# EAGLE design rpi2_lcd2 (EAGLE 7.7.0)
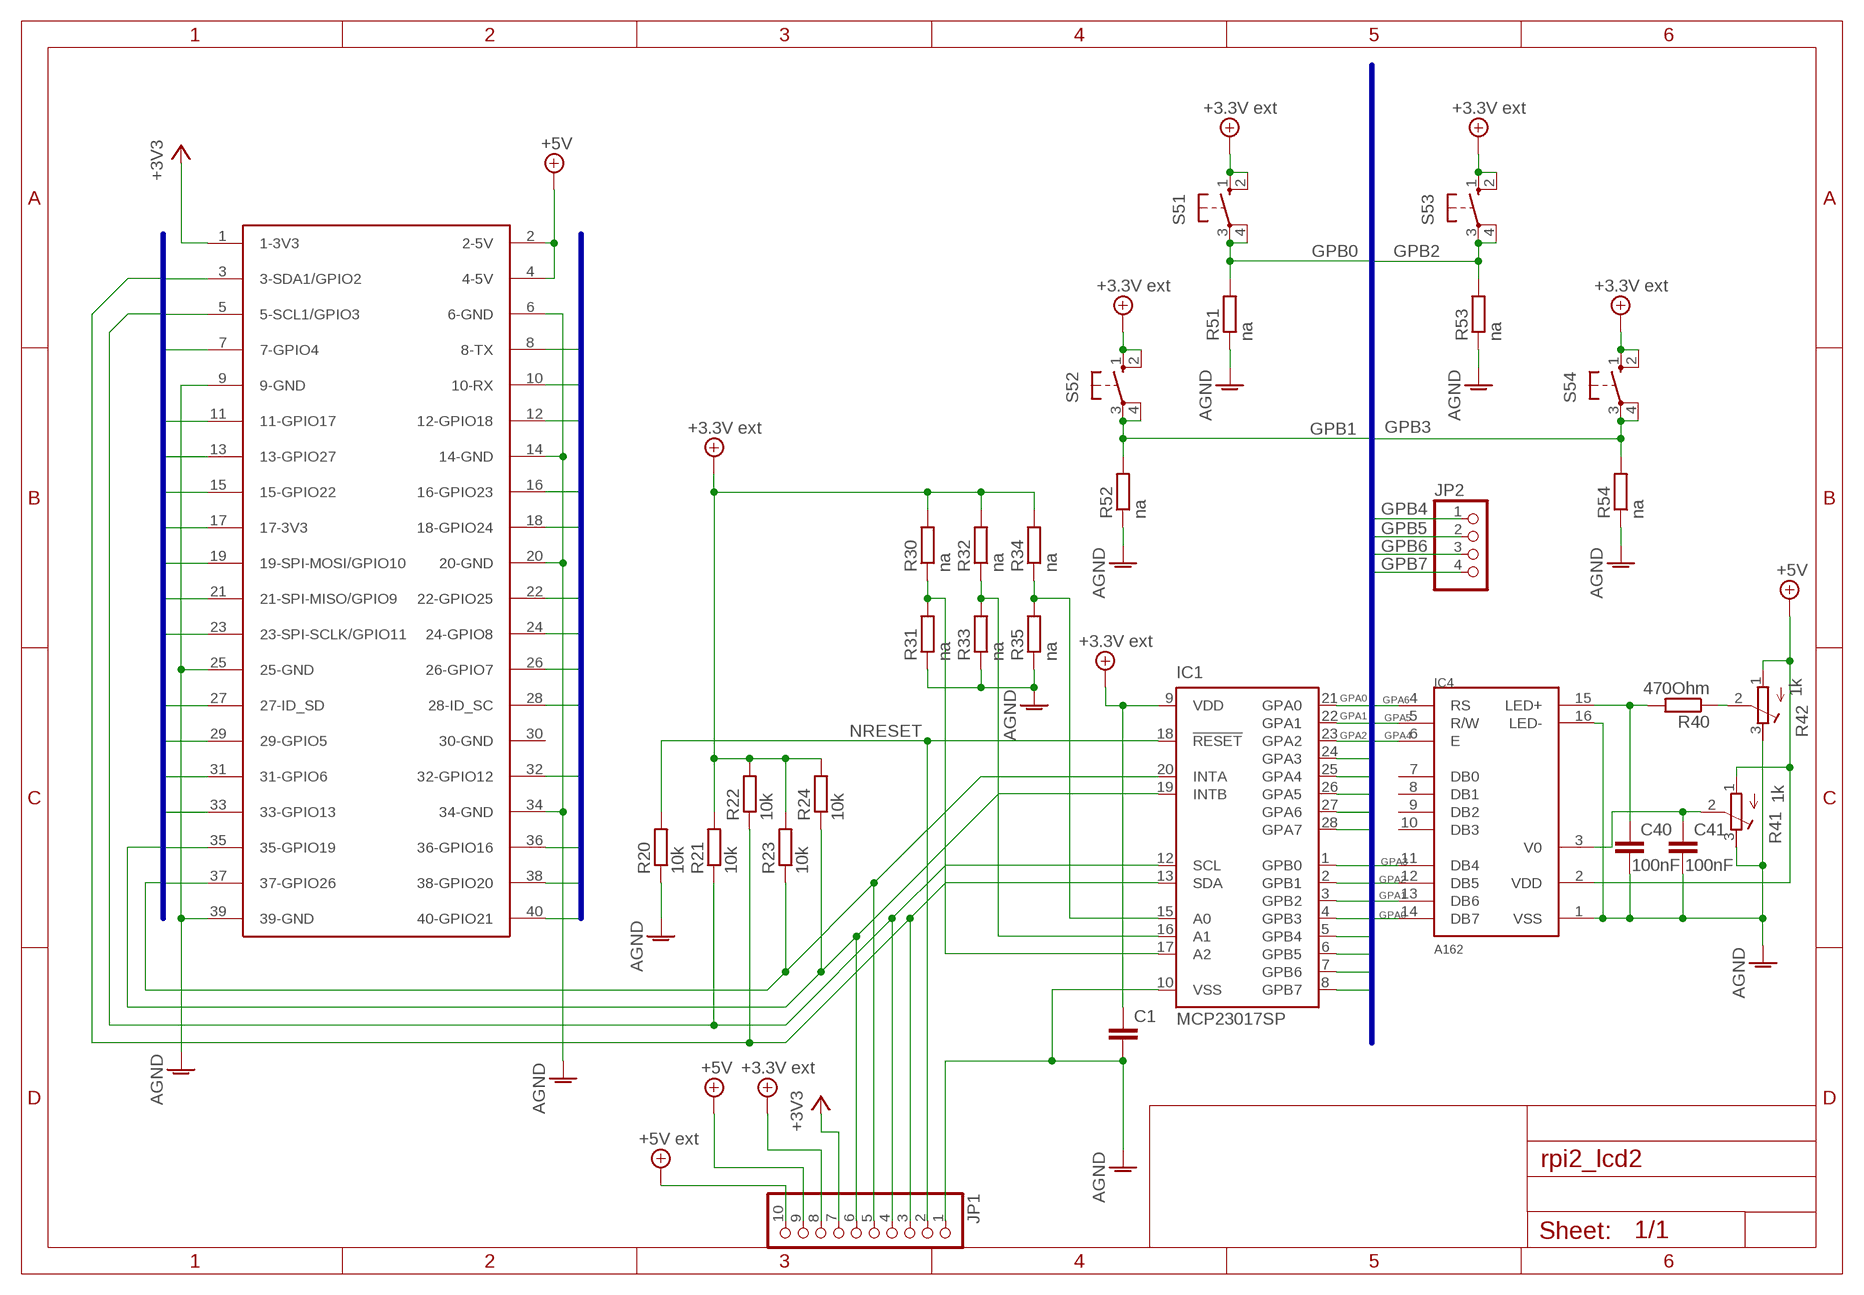
[diagram p0: schematic, sheet 1]

## Parts
C1  C-EUC1210  [C1210]
C40  100nF  C-EUC1210  [C1210]
C41  100nF  C-EUC1210  [C1210]
IC1  MCP23017SP  [DIL28-3]
IC4  A162  [A162]
JP1  PINHD-1X10  [1X10]
JP2  PINHD-1X4  [1X04]
R20  10k  R-EU_R0805  [R0805]
R21  10k  R-EU_R0805  [R0805]
R22  10k  R-EU_R0805  [R0805]
R23  10k  R-EU_R0805  [R0805]
R24  10k  R-EU_R0805  [R0805]
R30  na  R-EU_R0805  [R0805]
R31  na  R-EU_R0805  [R0805]
R32  na  R-EU_R0805  [R0805]
R33  na  R-EU_R0805  [R0805]
R34  na  R-EU_R0805  [R0805]
R35  na  R-EU_R0805  [R0805]
R40  470Ohm  R-EU_R0805  [R0805]
R41  1k  R-TRIMM3339P  [RTRIM3339P]
R42  1k  R-TRIMM3339P  [RTRIM3339P]
R51  na  R-EU_R0805  [R0805]
R52  na  R-EU_R0805  [R0805]
R53  na  R-EU_R0805  [R0805]
R54  na  R-EU_R0805  [R0805]
S51  10-XX  [B3F-10XX]
S52  10-XX  [B3F-10XX]
S53  10-XX  [B3F-10XX]
S54  10-XX  [B3F-10XX]
U$1  RASPBERRY-PI+HEADERONLY  [RASPBERRY-PI-PLUS-HEADERONLY]

## Nets
3.3VEXT: C1.1 IC1.9(VDD) JP1.8 R21.2 R22.2 R23.2 R24.2 R30.2 R32.2 R34.2 ; supply symbol labelled +3.3V ext
+3V3: JP1.7 U$1.1(1-3V3)
+5V: IC4.2(VDD) JP1.9 R41.1(A) R42.1(A) U$1.2(2-5V) U$1.4(4-5V)
+5V/1: JP1.10 ; supply symbol labelled +5V ext
+5V/2: S51.1(S) S51.2(S1) S52.1(S) S52.2(S1) S53.1(S) S53.2(S1) S54.1(S) S54.2(S1) ; supply symbol labelled +3.3V ext
AGND: C1.2 C40.2 C41.2 IC1.10(VSS) IC4.1(VSS) IC4.16(LED-) JP1.1 R20.1 R31.1 R33.1 R35.1 R41.3(E) R42.3(E) R51.1 R52.1 R53.1 R54.1 U$1.6(6-GND) U$1.9(9-GND) U$1.14(14-GND) U$1.20(20-GND) U$1.25(25-GND) U$1.34(34-GND) U$1.39(39-GND)
GPA0: IC1.21(GPA0) IC4.14(DB7)
GPA1: IC1.22(GPA1) IC4.13(DB6)
GPA2: IC1.23(GPA2) IC4.12(DB5)
GPA3: IC1.24(GPA3) IC4.11(DB4)
GPA4: IC1.25(GPA4) IC4.6(E)
GPA5: IC1.26(GPA5) IC4.5(R/W)
GPA6: IC1.27(GPA6) IC4.4(RS)
GPA7: IC1.28(GPA7)
GPB0: IC1.1(GPB0) R51.2 S51.3(P) S51.4(P1)
GPB1: IC1.2(GPB1) R52.2 S52.3(P) S52.4(P1)
GPB2: IC1.3(GPB2) R53.2 S53.3(P) S53.4(P1)
GPB3: IC1.4(GPB3) R54.2 S54.3(P) S54.4(P1)
GPB4: IC1.5(GPB4) JP2.1
GPB5: IC1.6(GPB5) JP2.2
GPB6: IC1.7(GPB6) JP2.3
GPB7: IC1.8(GPB7) JP2.4
GPIO3: IC1.13(SDA) JP1.3 R22.1 U$1.3(3-SDA1/GPIO2)
GPIO5: IC1.12(SCL) JP1.4 R21.1 U$1.5(5-SCL1/GPIO3)
GPIO7: U$1.7(7-GPIO4)
GPIO8: U$1.8(8-TX)
GPIO10: U$1.10(10-RX)
GPIO11: U$1.11(11-GPIO17)
GPIO12: U$1.12(12-GPIO18)
GPIO13: U$1.13(13-GPIO27)
GPIO15: U$1.15(15-GPIO22)
GPIO16: U$1.16(16-GPIO23)
GPIO17: U$1.17(17-3V3)
GPIO18: U$1.18(18-GPIO24)
GPIO19: U$1.19(19-SPI-MOSI/GPIO10)
GPIO21: U$1.21(21-SPI-MISO/GPIO9)
GPIO22: U$1.22(22-GPIO25)
GPIO23: U$1.23(23-SPI-SCLK/GPIO11)
GPIO24: U$1.24(24-GPIO8)
GPIO26: U$1.26(26-GPIO7)
GPIO27: U$1.27(27-ID_SD)
GPIO28: U$1.28(28-ID_SC)
GPIO29: U$1.29(29-GPIO5)
GPIO31: U$1.31(31-GPIO6)
GPIO32: U$1.32(32-GPIO12)
GPIO33: U$1.33(33-GPIO13)
GPIO35: IC1.19(INTB) JP1.6 R24.1 U$1.35(35-GPIO19)
GPIO36: U$1.36(36-GPIO16)
GPIO37: IC1.20(INTA) JP1.5 R23.1 U$1.37(37-GPIO26)
GPIO38: U$1.38(38-GPIO20)
GPIO40: U$1.40(40-GPIO21)
N$1: R40.1 R42.2(S)
N$2: C40.1 IC4.15(LED+) R40.2
N$3: C41.1 IC4.3(V0) R41.2(S)
N$23: IC1.17(A2) R30.1 R31.2
N$29: IC1.16(A1) R32.1 R33.2
N$30: IC1.15(A0) R34.1 R35.2
NRESET: IC1.18(!RESET) JP1.2 R20.2
Unconnected: IC4.7(DB0) IC4.8(DB1) IC4.9(DB2) IC4.10(DB3) U$1.30(30-GND)

## Buses
GPA[0..7],GPB[0..7]
GPIO[1..40]

## Library data of the parts
C1 C40 C41 = rcl:C-EU: CAPACITOR, European symbol
IC1 = microchip:MCP23017: http://ww1.microchip.com/downloads/en/DeviceDoc/21952a.pdf Source: http://ww1.microchip.com/downloads/en/DeviceDoc/21952a.pdf; MF: MICROCHIP; MPN: MCP23017-E/SP; OC_FARNELL: 1332088; OC_NEWARK: 31K2959
IC4 = display:A162
JP1 = pinhead:PINHD-1X10: PIN HEADER
JP2 = pinhead:PINHD-1X4: PIN HEADER
R20-R24 R30-R35 R40 R51-R54 = rcl:R-EU_: RESISTOR, European symbol
R41 R42 = rcl:R-TRIMM: Trimm resistor
S51-S54 = switch-omron:10-XX: OMRON SWITCH; MPN: B3F-1000; OC_FARNELL: 176432; OC_NEWARK: 36M3542
U$1 = Ava:RASPBERRY-PI+: Samtec SSW-120-01-T-D

## Board
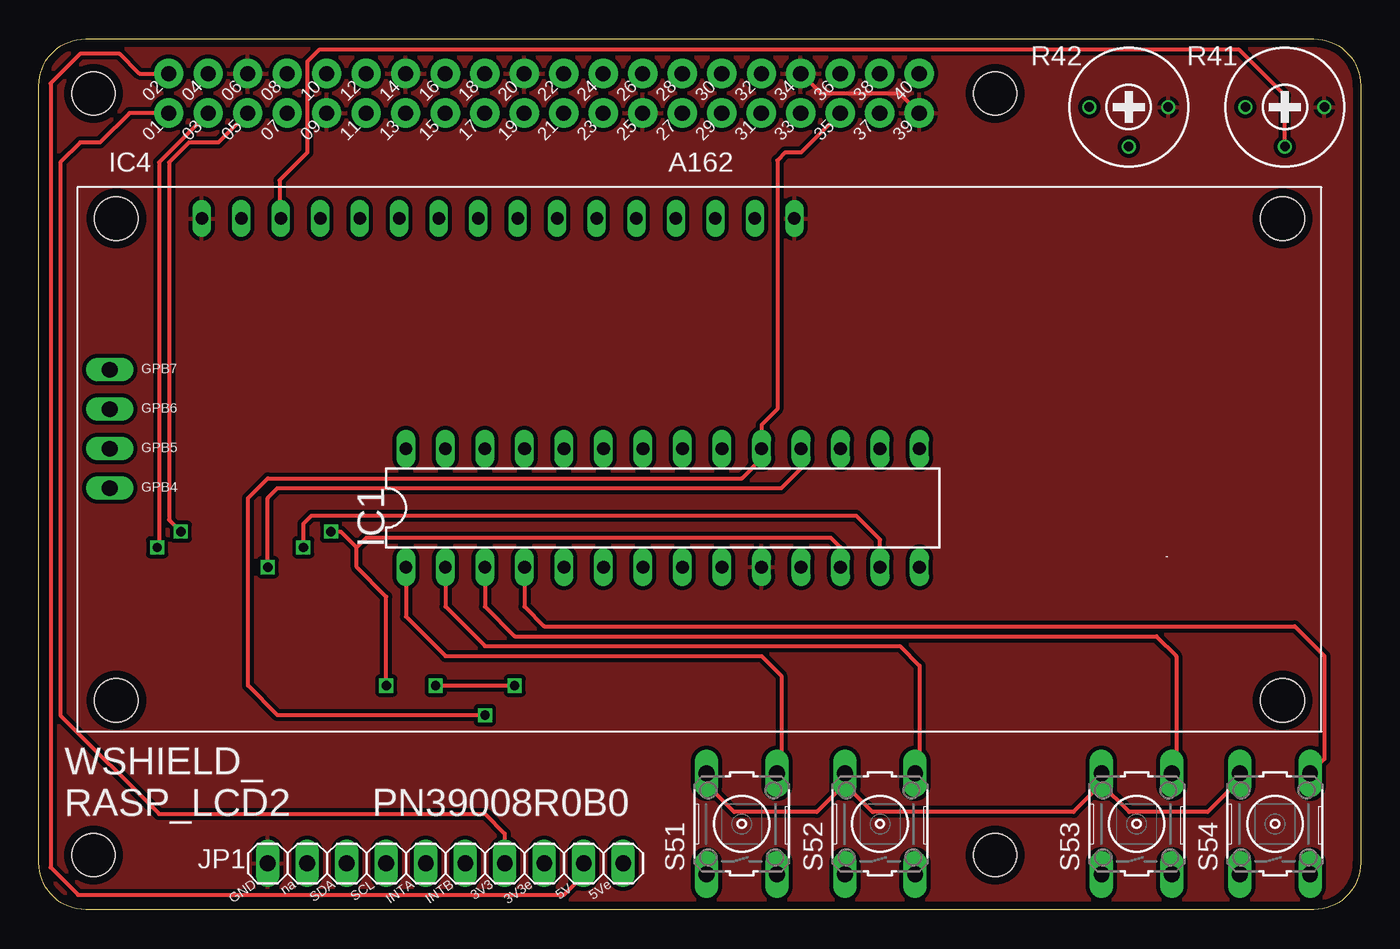
[diagram p1: board, top side]
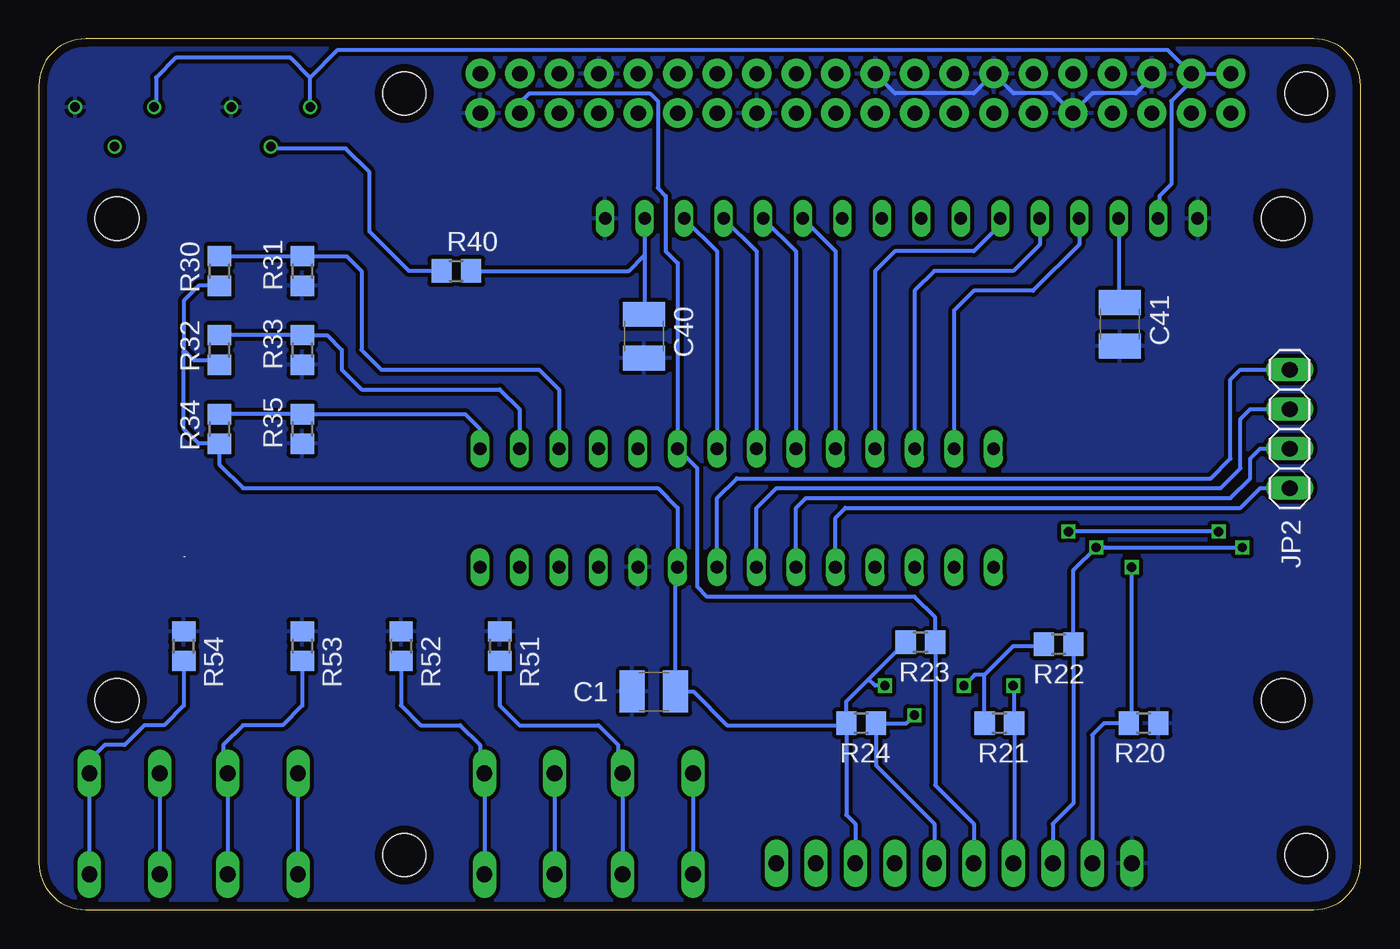
[diagram p2: board, bottom side, seen from below]

Size 85 x 56 mm. Coordinates in mm from the lower left corner, seen from the top.
Outline: 0,53 arc-90 3,56 82,56 arc-90 85,53 85,3 arc-90 82,0 3,0 arc-90 0,3 0,53
Copper layers (1*16): Top 0.035mm / dielectric 1.6mm / Bottom 0.035mm
Design rules "Elecrow_2-layer_PCB_eagle_rule": minimum track width 6mil, minimum drill 12mil, track to track 6mil, track to pad 6mil, pad to pad 6mil, via to via 8mil, smd to smd 0mil, copper to edge 20mil, drill to drill 10mil, minimum pad ring 6mil, minimum via ring 6mil, stop-mask expansion 0mil, vias tented up to drill 100mil, thermal gap 10mil
Holes 2.75 mm at 3.5,52.5 3.5,3.5 61.5,52.5 61.5,3.5

### Footprints (pad centres in the part's own frame; a part is rotated, then mirrored left to right if it is on the bottom)
C1210 = smd 1.6 x 2.7: 1 -1.4,0; 2 1.4,0
DIL28-3 = drill 0.813 long: 1 -16.51,-3.81; 2 -13.97,-3.81; 3 -11.43,-3.81; 4 -8.89,-3.81; 5 -6.35,-3.81; 6 -3.81,-3.81; 7 -1.27,-3.81; 8 1.27,-3.81; 9 3.81,-3.81; 10 6.35,-3.81; 11 8.89,-3.81; 12 11.43,-3.81; 13 13.97,-3.81; 14 16.51,-3.81; 15 16.51,3.81; 16 13.97,3.81; 17 11.43,3.81; 18 8.89,3.81; 19 6.35,3.81; 20 3.81,3.81; 21 1.27,3.81; 22 -1.27,3.81; 23 -3.81,3.81; 24 -6.35,3.81; 25 -8.89,3.81; 26 -11.43,3.81; 27 -13.97,3.81; 28 -16.51,3.81
A162 = drill 0.8 long: 1 0,0; 2 2.54,0; 3 5.08,0; 4 7.62,0; 5 10.16,0; 6 12.7,0; 7 15.24,0; 8 17.78,0; 9 20.32,0; 10 22.86,0; 11 25.4,0; 12 27.94,0; 13 30.48,0; 14 33.02,0; 15 35.56,0; 16 38.1,0 | hole 2.8: -5.5,0; -5.5,-31; 69.5,0; 69.5,-31
1X10 = drill 1.016 long: 1 -11.43,0; 2 -8.89,0; 3 -6.35,0; 4 -3.81,0; 5 -1.27,0; 6 1.27,0; 7 3.81,0; 8 6.35,0; 9 8.89,0; 10 11.43,0
1X04 = drill 1.016 long: 1 -3.81,0; 2 -1.27,0; 3 1.27,0; 4 3.81,0
R0805 = smd 1.3 x 1.5: 1 -0.95,0; 2 0.95,0
RTRIM3339P = drill 0.61: 1 -2.54,0; 2 0,-2.54; 3 2.54,0
B3F-10XX = drill 1.016 long: 1 -3.251,2.261; 2 3.251,2.261; 3 -3.251,-2.261; 4 3.251,-2.261
RASPBERRY-PI-PLUS-HEADERONLY = drill 0.97 pad 1.88: 1 -23.97,-1.218; 2 -23.97,1.323; 3 -21.43,-1.218; 4 -21.43,1.323; 5 -18.89,-1.218; 6 -18.89,1.323; 7 -16.35,-1.218; 8 -16.35,1.323; 9 -13.81,-1.218; 10 -13.81,1.323; 11 -11.27,-1.218; 12 -11.27,1.323; 13 -8.73,-1.218; 14 -8.73,1.323; 15 -6.19,-1.218; 16 -6.19,1.323; 17 -3.65,-1.218; 18 -3.65,1.323; 19 -1.11,-1.218; 20 -1.11,1.323; 21 1.43,-1.218; 22 1.43,1.323; 23 3.97,-1.218; 24 3.97,1.323; 25 6.51,-1.218; 26 6.51,1.323; 27 9.05,-1.218; 28 9.05,1.323; 29 11.59,-1.218; 30 11.59,1.323; 31 14.13,-1.218; 32 14.14,1.323; 33 16.67,-1.218; 34 16.67,1.323; 35 19.21,-1.218; 36 19.21,1.323; 37 21.75,-1.218; 38 21.75,1.323; 39 24.29,-1.218; 40 24.29,1.323

### Placement (x,y rotation side)
C1  45.45,14.02 180 bottom
C40  46.09,36.88 270 bottom
C41  15.48,37.64 270 bottom
IC1  40.12,25.83 0 top
IC4  10.48,44.45 0 top
JP1  26.15,2.97 0 top
JP2  4.56,30.91 90 bottom
R20  13.96,11.99 180 bottom
R21  23.23,11.99 180 bottom
R22  19.42,17.07 180 bottom
R23  28.31,17.19 180 bottom
R24  32.12,11.99 180 bottom
R30  73.39,41.07 270 bottom
R31  68.06,41.07 90 bottom
R32  73.39,35.99 270 bottom
R33  68.06,35.99 90 bottom
R34  73.39,30.91 270 bottom
R35  68.06,30.91 90 bottom
R40  58.15,41.07 0 bottom
R41  80.12,51.61 0 top
R42  70.09,51.61 0 top
R51  55.36,16.94 270 bottom
R52  61.71,16.94 270 bottom
R53  68.06,16.94 270 bottom
R54  75.68,16.94 270 bottom
S51  45.2,5.51 90 top
S52  54.09,5.51 90 top
S53  70.6,5.51 90 top
S54  79.49,5.51 90 top
U$1  32.32,52.45 0 top
U$2  [BRAND_SWI]  80.76,20.12 0 bottom
U$3  [BRAND_SWI]  67.42,20.12 0 top

### Tracks (layer width: path | path; a pad name or v marks a point on that pad's centre or on a via)
3.3VEXT  (via drill 0.6)
  Top 0.254: v25.52,14.4 v30.59,14.4
  Bottom 0.254: R30.2 74.72,40.12 75.68,39.16 75.68,35.99 | 75.68,35.99 75.04,35.36 73.71,35.36 R32.2 | 75.68,35.99 75.68,30.91 74.73,29.96 R34.2 73.39,28.62 71.87,27.1 45.2,27.1 43.93,25.83 IC1.9 44.05,21.9 C1.1 42.91,14.02 40.76,11.86 33.2,11.86 R24.2 | R24.2 33.07,6.08 32.5,5.51 JP1.8 | R24.2 33.07,13.38 31.64,14.81 | 31.64,14.81 R23.2 | R21.2 24.18,15.1 | 24.18,15.1 22.34,16.94 20.5,16.94 R22.2 | 24.18,15.1 24.81,15.1 v25.52,14.4 | v30.59,14.4 31.23,14.4 31.64,14.81
+3V3
  Top 0.254: U$1.1 5.83,51.23 3.92,49.33 2.66,49.33 1.38,48.05 1.38,12.5 7.74,6.15 28.69,6.15 29.96,4.88 JP1.7
+5V
  Top 0.254: U$1.2 6.46,53.77 5.2,55.04 2.66,55.04 0.75,53.13 0.75,2.72 2.53,0.94 33.77,0.94 35.04,2.21 JP1.9
  Bottom 0.254: 67.55,53.52 68.82,54.79 76.19,54.79 77.46,53.52 77.46,51.74 R41.1 | R42.1 67.55,53.52 | 67.55,53.52 65.77,55.29 12.41,55.29 U$1.4 | U$1.4 10.89,53.28 12.18,51.99 12.18,46.66 12.94,45.9 12.94,44.52 IC4.2 | U$1.4 U$1.2
+5V/2
  Top 0.254: S54.2 77.23,8.33 75.17,6.27 70.12,6.27 68.34,8.05 S53.2 68.34,8.08 66.54,6.27 53.61,6.27 51.83,8.05 S52.2 51.83,8.08 50.03,6.27 44.72,6.27 42.94,8.05 S51.2
  Bottom 0.254: S52.2 S52.1 | S51.2 S51.1 | S53.1 S53.2 | S54.2 S54.1
AGND
  Top 0.254: U$1.34 49.01,53.77 50.28,52.5 55.34,52.5 U$1.39
  Bottom 0.254: U$1.6 13.43,53.53 14.47,52.5 17.24,52.5 U$1.9 18.53,51.23 19.8,52.5 22.32,52.5 U$1.14 23.61,53.77 24.88,52.5 29.94,52.5 U$1.20
  pour Bottom (isolate 0.254): -0.01,53.26 arc-90 2.78,56.06 3.04,56.06 82.28,56.06 arc-90 85.08,53.26 85.08,2.72 arc-90 82.28,-0.08 82.03,-0.08 3.04,-0.08 arc-90 -0.01,2.97
  pour Top (isolate 0.254): -0.01,53.26 arc-90 2.78,56.06 3.29,56.06 82.54,56.06 arc-90 85.08,53.52 85.08,53.01 85.08,2.72 arc-90 82.28,-0.08 82.03,-0.08 2.78,-0.08 arc-90 -0.01,2.72
GPA0
  Bottom 0.254: IC4.14 41.39,42.34 IC1.21
GPA1
  Bottom 0.254: IC4.13 38.85,42.34 IC1.22
GPA2
  Bottom 0.254: IC4.12 36.31,42.34 IC1.23
GPA3
  Bottom 0.254: IC4.11 33.77,42.34 IC1.24
GPA4
  Bottom 0.254: IC4.6 23.18,44.04 24.88,42.34 29.96,42.34 31.23,41.07 IC1.25
GPA5
  Bottom 0.254: IC4.5 20.64,42.77 22.34,41.07 27.42,41.07 28.69,39.8 IC1.26
GPA6
  Bottom 0.254: IC4.4 18.1,42.77 21.07,39.8 24.88,39.8 26.15,38.53 IC1.27
GPB0
  Top 0.254: IC1.1 23.61,18.84 26.15,16.3 46.47,16.3 47.74,15.04 47.74,9.04 S51.4
  Bottom 0.254: R51.2 55.36,13.13 54.09,11.86 49.01,11.86 47.74,10.59 47.74,9.04 S51.4 S51.3
GPB1
  Top 0.254: IC1.2 26.15,19.48 28.69,16.94 55.36,16.94 56.63,15.67 56.63,9.04 S52.4
  Bottom 0.254: R52.2 61.71,13.13 60.44,11.86 57.9,11.86 56.63,10.59 56.63,9.04 S52.4 S52.3
GPB2
  Top 0.254: IC1.3 28.69,19.48 30.59,17.57 71.87,17.57 73.14,16.3 73.14,9.04 S53.4
  Bottom 0.254: R53.2 68.06,13.13 69.33,11.86 71.87,11.86 73.14,10.59 73.14,9.04 S53.4 S53.3
GPB3
  Top 0.254: IC1.4 31.23,19.48 32.5,18.21 80.76,18.21 82.66,16.3 82.66,9.68 S54.4
  Bottom 0.254: R54.2 75.68,13.13 76.95,11.86 78.22,11.86 79.49,10.59 80.76,10.59 82.03,9.32 82.03,9.04 S54.4 S54.3
GPB4
  Bottom 0.254: IC1.5 33.77,25.2 33.13,25.83 7.74,25.83 6.47,27.1 JP2.1
GPB5
  Bottom 0.254: IC1.6 36.31,25.83 35.68,26.46 8.37,26.46 7.1,27.73 7.1,29 6.47,29.64 JP2.2
GPB6
  Bottom 0.254: IC1.7 38.85,25.83 37.58,27.1 9,27.1 7.74,28.37 7.74,31.55 7.1,32.18 JP2.3
GPB7
  Bottom 0.254: IC1.8 41.39,26.46 40.12,27.73 9.64,27.73 8.37,29 8.37,34.09 7.74,34.72 JP2.4
GPIO3  (via drill 0.6)
  Top 0.254: U$1.3 10.89,51.21 7.74,48.05 7.74,23.42 v7.61,23.29 | IC1.13 54.09,23.8 52.57,25.32 17.51,25.32 17.01,24.81 v17.01,23.29
  Bottom 0.254: JP1.3 19.8,5.51 18.47,6.84 R22.1 18.47,21.83 v17.01,23.29 16.5,23.29 v7.61,23.29
GPIO5  (via drill 0.6)
  Top 0.254: v22.34,14.4 22.34,20.12 20.44,22.02 20.44,23.29 | 20.44,23.29 21.07,23.93 50.91,23.93 51.55,23.29 IC1.12 | U$1.5 13.43,51.21 11.55,49.33 9.64,49.33 8.37,48.05 8.37,25.07 v9.13,24.31 | v18.78,24.31 19.42,24.31 20.44,23.29
  Bottom 0.254: JP1.4 22.28,3.03 R21.1 22.28,14.34 v22.34,14.4 | v9.13,24.31 v18.78,24.31
GPIO35  (via drill 0.6)
  Top 0.254: v28.69,12.5 15.36,12.5 13.45,14.4 13.45,26.46 14.72,27.73 45.2,27.73 46.47,29 IC1.19 46.47,31.16 47.49,32.18 47.49,48.18 47.99,48.69 49.01,48.69 51.53,51.21 U$1.35
  Bottom 0.254: JP1.6 27.42,5.51 31.17,9.26 R24.1 29.2,11.99 v28.69,12.5
GPIO37
  Bottom 0.254: JP1.5 24.88,5.51 27.36,7.99 R23.1 27.36,18.78 28.69,20.12 42.02,20.12 42.66,20.75 42.66,28.37 IC1.20 43.93,41.58 44.69,42.34 44.69,45.9 45.2,46.4 45.2,51.99 45.71,52.5 53.45,52.5 54.07,51.88 U$1.37
N$1
  Bottom 0.254: R40.1 61.2,41.07 63.74,43.61 63.74,47.42 65.27,48.94 69.96,48.94 R42.2
N$2
  Bottom 0.254: IC4.15 46.04,42.09 | 46.04,42.09 46.04,38.33 C40.1 | R40.2 47.05,41.07 46.04,42.09
N$3
  Top 0.254: R41.2 80.12,52.37 77.2,55.29 18.02,55.29 17.26,54.53 17.26,48.69 15.48,46.91 15.48,44.52 IC4.3
  Bottom 0.254: IC4.3 15.56,39.12 C41.1
N$23
  Bottom 0.254: IC1.17 51.55,33.45 52.82,34.72 62.98,34.72 64.25,35.99 64.25,41.07 65.2,42.02 R31.2 R30.1
N$29
  Bottom 0.254: IC1.16 54.09,32.18 55.36,33.45 64.25,33.45 65.52,34.72 65.52,35.99 66.47,36.94 R33.2 R32.1
N$30
  Bottom 0.254: IC1.15 56.63,30.91 57.58,31.86 R35.2 R34.1
NRESET  (via drill 0.6)
  Top 0.254: v14.72,22.02 14.72,26.46 15.36,27.1 47.74,27.1 49.01,28.37 IC1.18
  Bottom 0.254: v14.72,22.02 14.72,11.99 R20.2 16.5,11.99 17.26,11.23 JP1.2

### Text on the board
tNames: 02 | 04 | 06 | 08 | 10 | 12 | 14 | 16 | 18 | 20 | 22 | 24 | 26 | 28 | 30 | 32 | 34 | 36 | 38 | 40 | 01 | 03 | 05 | 07 | 09 | 11 | 13 | 15 | 17 | 19 | 21 | 23 | 25 | 27 | 29 | 31 | 33 | 35 | 37 | 39 | GPB7 | GPB6 | GPB5 | GPB4 | PN39008R0B0 | WSHIELD_ / RASP_LCD2 | GND | na | SDA | SCL | INTA | INTB | 3V3 | 3V3e | 5V | 5Ve
tTest: GND | SDA | SCL | INTB | INTA | 3.3V | 3.3Ve | 5V | 5Ve